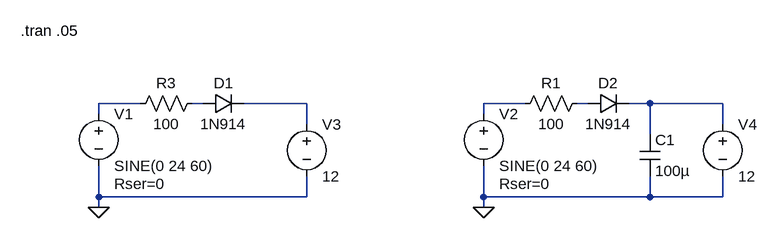
[diagram p0: schematic Diodo - RetificadorMeiaOnda - Fonte e Resistor.asc]
Diodo - RetificadorMeiaOnda - Fonte e Resistor.asc, the LTspice schematic file:
Version 4
SHEET 1 880 680
WIRE -320 0 -384 0
WIRE -224 0 -240 0
WIRE -64 0 -160 0
WIRE 272 0 208 0
WIRE 368 0 352 0
WIRE 464 0 432 0
WIRE 576 0 464 0
WIRE -384 16 -384 0
WIRE 208 16 208 0
WIRE -64 32 -64 0
WIRE 576 32 576 0
WIRE 464 48 464 0
WIRE -384 144 -384 96
WIRE -64 144 -64 112
WIRE -64 144 -384 144
WIRE 208 144 208 96
WIRE 464 144 464 112
WIRE 464 144 208 144
WIRE 576 144 576 112
WIRE 576 144 464 144
WIRE -384 160 -384 144
WIRE 208 160 208 144
FLAG -384 160 0
FLAG 208 160 0
SYMBOL diode -224 16 R270
WINDOW 0 32 32 VTop 2
WINDOW 3 0 32 VBottom 2
SYMATTR InstName D1
SYMATTR Value 1N914
SYMBOL voltage -384 0 R0
WINDOW 123 0 0 Left 2
WINDOW 39 24 124 Left 2
SYMATTR SpiceLine Rser=0
SYMATTR InstName V1
SYMATTR Value SINE(0 24 60)
SYMBOL diode 368 16 R270
WINDOW 0 32 32 VTop 2
WINDOW 3 0 32 VBottom 2
SYMATTR InstName D2
SYMATTR Value 1N914
SYMBOL voltage 208 0 R0
WINDOW 123 0 0 Left 2
WINDOW 39 24 124 Left 2
SYMATTR SpiceLine Rser=0
SYMATTR InstName V2
SYMATTR Value SINE(0 24 60)
SYMBOL cap 448 48 R0
SYMATTR InstName C1
SYMATTR Value 100µ
SYMBOL res -224 -16 R90
WINDOW 0 0 56 VBottom 2
WINDOW 3 32 56 VTop 2
SYMATTR InstName R3
SYMATTR Value 100
SYMBOL voltage -64 16 R0
WINDOW 123 0 0 Left 2
SYMATTR SpiceLine Rser=0
SYMATTR InstName V3
SYMATTR Value 12
SYMBOL res 368 -16 R90
WINDOW 0 0 56 VBottom 2
WINDOW 3 32 56 VTop 2
SYMATTR InstName R1
SYMATTR Value 100
SYMBOL voltage 576 16 R0
SYMATTR SpiceLine Rser=0
SYMATTR InstName V4
SYMATTR Value 12
TEXT -504 -112 Left 2 !.tran .05

The netlist it stands for:
* Diodo - RetificadorMeiaOnda - Fonte e Resistor.asc
D1 N002 N003 1N914
V1 N001 0 SINE(0 24 60) Rser=0
D2 N005 N006 1N914
V2 N004 0 SINE(0 24 60) Rser=0
C1 N006 0 100µ
R3 N002 N001 100
V3 N003 0 12 Rser=0
R1 N005 N004 100
V4 N006 0 12 Rser=0
.model D D
.lib standard.dio
.tran .05
.backanno
.end